# EAGLE schematic harp load cells interface v1.1 (EAGLE 6.5.0)

## Sheet 1 of 3
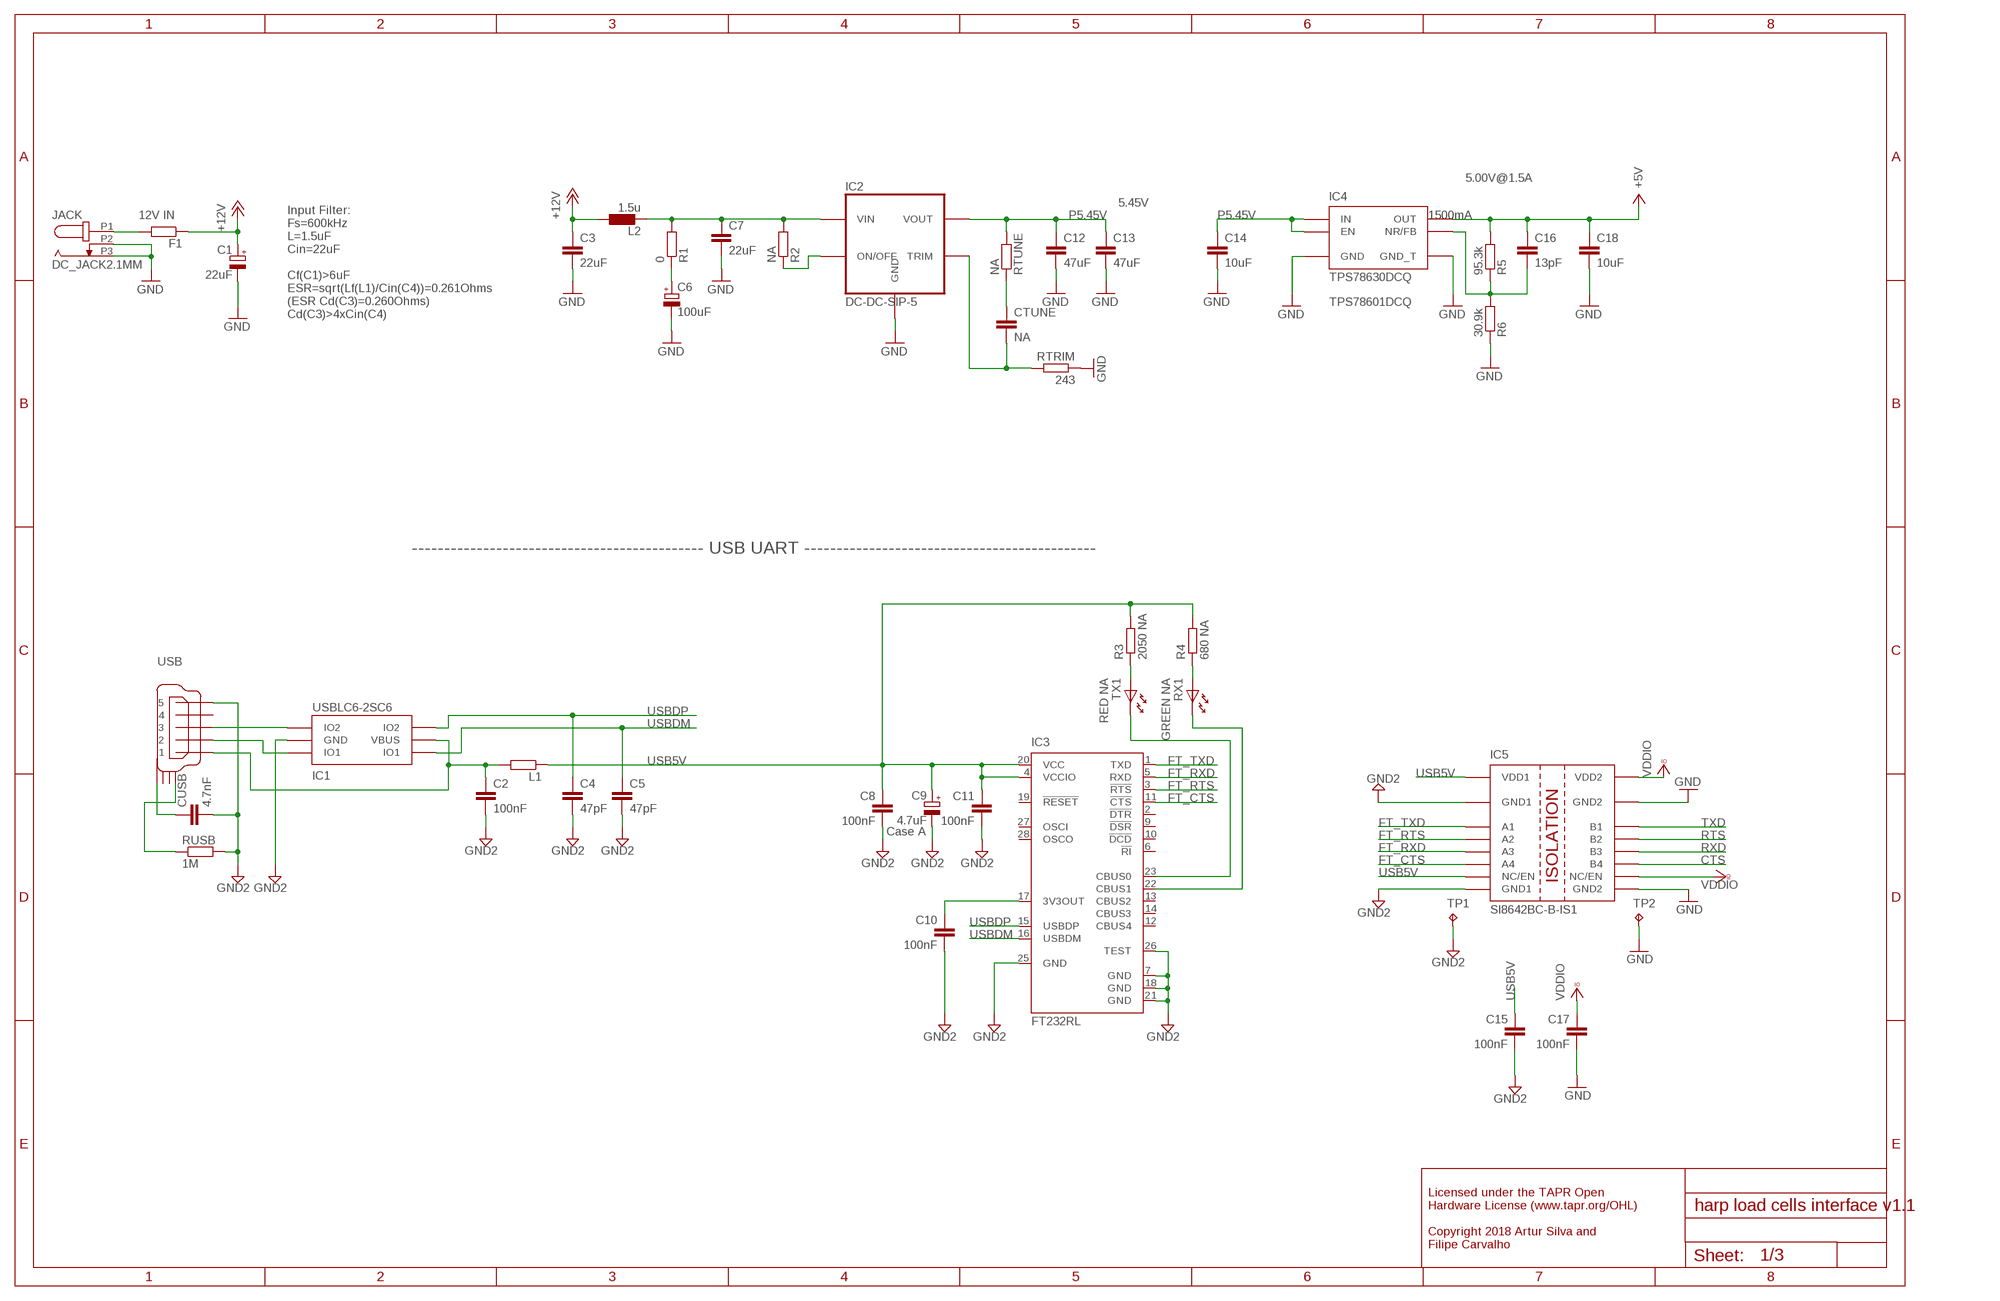
[diagram p0: schematic, sheet 1]

### Parts
C1  22uF  CAP_100UFHAND  [CAP_100UF_HAND]
C2  100nF  C-EUC0402  [C0402]
C3  22uF  C-EUC1210  [C1210]
C4  47pF  C-EUC0402  [C0402]
C5  47pF  C-EUC0402  [C0402]
C6  100uF  CPOL-EUE  [PANASONIC_E]
C7  22uF  C-EUC1210  [C1210]
C8  100nF  C-EUC0402  [C0402]
C9  4.7uF  CPOL-EUA/3216-18W  [A/3216-18W]
C10  100nF  C-EUC0402  [C0402]
C11  100nF  C-EUC0402  [C0402]
C12  47uF  C-EUC1210  [C1210]
C13  47uF  C-EUC1210  [C1210]
C14  10uF  C-EUC0603  [C0603]
C15  100nF  C-EUC0402  [C0402]
C16  13pF  C-EUC0402  [C0402]
C17  100nF  C-EUC0402  [C0402]
C18  10uF  C-EUC0603  [C0603]
CTUNE  NA  C-EUC0402  [C0402]
CUSB  4.7nF  C-EUC0402  [C0402]
F1  1A FB  R-EU_R0603  [R0603]
IC1  USBLC6-2SC6  USBLC6-2  [SOT23-6L]
IC2  DC-DC-SIP-5  [SIP-5]
IC3  FT232RL  [SSOP28]
IC4  TPS78630DCQ  TPS795XX  [SOT223-6]
IC5  SI8642BC-B-IS1  SI8645  [NSOIC-16]
JACK  DC_JACK2.1MM  [DC_POWER_INPUT_2.1MM]
L1  ???  R-EU_R0805  [R0805]
L2  1.5u  INDLPS4012  [IND_LPS4012]
R1  0  R-EU_R0402  [R0402]
R2  NA  R-EU_R0402  [R0402]
R3  2050 NA  R-EU_R0402  [R0402]
R4  680 NA  R-EU_R0402  [R0402]
R5  95.3k  R-EU_R0402  [R0402]
R6  30.9k  R-EU_R0402  [R0402]
RTRIM  243  R-EU_R0402  [R0402]
RTUNE  NA  R-EU_R0402  [R0402]
RUSB  1M  R-EU_R0402  [R0402]
RX1  GREEN NA  LEDHAND  [LED_HAND]
TP1  TPTP08SQ  [TP08SQ]
TP2  TPTP08SQ  [TP08SQ]
TX1  RED NA  LEDHAND  [LED_HAND]
USB  USB_MINI_B  [240-0002-1]

### Nets
3V3OUT: C10.1 IC3.17(3V3OUT)
+5V: C16.1 C18.1 IC4.P$4(OUT) R5.2 ; also sheet 2,3
+12V: C1.+ C3.1 F1.1 L2.1
CTS: IC5.11(B4) ; also sheet 2
DCIN: C7.1 IC2.P2(VIN) L2.2 R1.2 R2.2
FT_CTS: IC3.11(!CTS) IC5.6(A4)
FT_RTS: IC3.3(!RTS) IC5.4(A2)
FT_RXD: IC3.5(RXD) IC5.5(A3)
FT_TXD: IC3.1(TXD) IC5.3(A1)
GND: C1.- C3.2 C6.- C7.2 C12.2 C13.2 C14.2 C17.2 C18.2 IC2.P3(GND) IC4.P$3(GND) IC4.P$6(GND_T) IC5.9(GND2) IC5.15(GND2) JACK.P2 JACK.P3 R6.1 RTRIM.1 TP2.TP ; also sheet 2,3
GND2: C2.2 C4.2 C5.2 C8.2 C9.- C10.2 C11.2 C15.2 CUSB.2 IC1.P$2(GND) IC3.7(GND) IC3.18(GND) IC3.21(GND) IC3.25(GND) IC3.26(TEST) IC5.2(GND1) IC5.8(GND1) RUSB.2 TP1.TP USB.P$5
N$5: R4.1 RX1.A
N$7: IC3.22(CBUS1) RX1.K
N$12: CTUNE.2 IC2.P5(TRIM) RTRIM.2
N$13: IC1.P$3(IO2) USB.P$3
N$14: CTUNE.1 RTUNE.1
N$15: CUSB.1 USB.SHIELD_4
N$16: IC2.P1(ON/OFF) R2.1
N$18: F1.2 JACK.P1
N$20: C16.2 IC4.P$5(NR/FB) R5.1 R6.2
N$24: C6.+ R1.1
N$60: C2.1 IC1.P$5(VBUS) L1.2 USB.P$1
N$401: R3.1 TX1.A
N$591: IC3.23(CBUS0) TX1.K
N$601: RUSB.1 USB.SHIELD_1
N$701: IC1.P$1(IO1) USB.P$2
P5.45V: C12.1 C13.1 C14.1 IC2.P4(VOUT) IC4.P$1(EN) IC4.P$2(IN) RTUNE.2
RTS: IC5.13(B2) ; also sheet 2
RXD: IC5.12(B3) ; also sheet 2
TXD: IC5.14(B1) ; also sheet 2
USB5V: C8.1 C9.+ C11.1 C15.1 IC3.4(VCCIO) IC3.20(VCC) IC5.1(VDD1) IC5.7(NC/EN) L1.1 R3.2 R4.2
USBDM: C5.1 IC1.P$6(IO1) IC3.16(USBDM)
USBDP: C4.1 IC1.P$4(IO2) IC3.15(USBDP)
VCCIO: C17.1 IC5.10(NC/EN) IC5.16(VDD2) ; supply symbol labelled VDDIO ; also sheet 2,3
Unconnected: IC3.2(!DTR) IC3.6(!RI) IC3.9(!DSR) IC3.10(!DCD) IC3.12(CBUS4) IC3.13(CBUS2) IC3.14(CBUS3) IC3.19(!RESET) IC3.27(OSCI) IC3.28(OSCO) USB.P$4 USB.SHIELD_2 USB.SHIELD_3

### Notes on the sheet
- 5.00V@1.5A
- 5.45V
- 12V IN | 1500mA
- TPS78601DCQ
- Input Filter:
  Fs=600kHz
  L=1.5uF
  Cin=22uF
  
  Cf(C1)>6uF
  ESR=sqrt(Lf(L1)/Cin(C4))=0.261Ohms
  (ESR Cd(C3)=0.260Ohms)
  Cd(C3)>4xCin(C4)
- --------------------------------------------- USB UART ---------------------------------------------
- Case A
- Licensed under the TAPR Open
  Hardware License (www.tapr.org/OHL)
  
  Copyright 2018 Artur Silva and 
  Filipe Carvalho

## Sheet 2 of 3
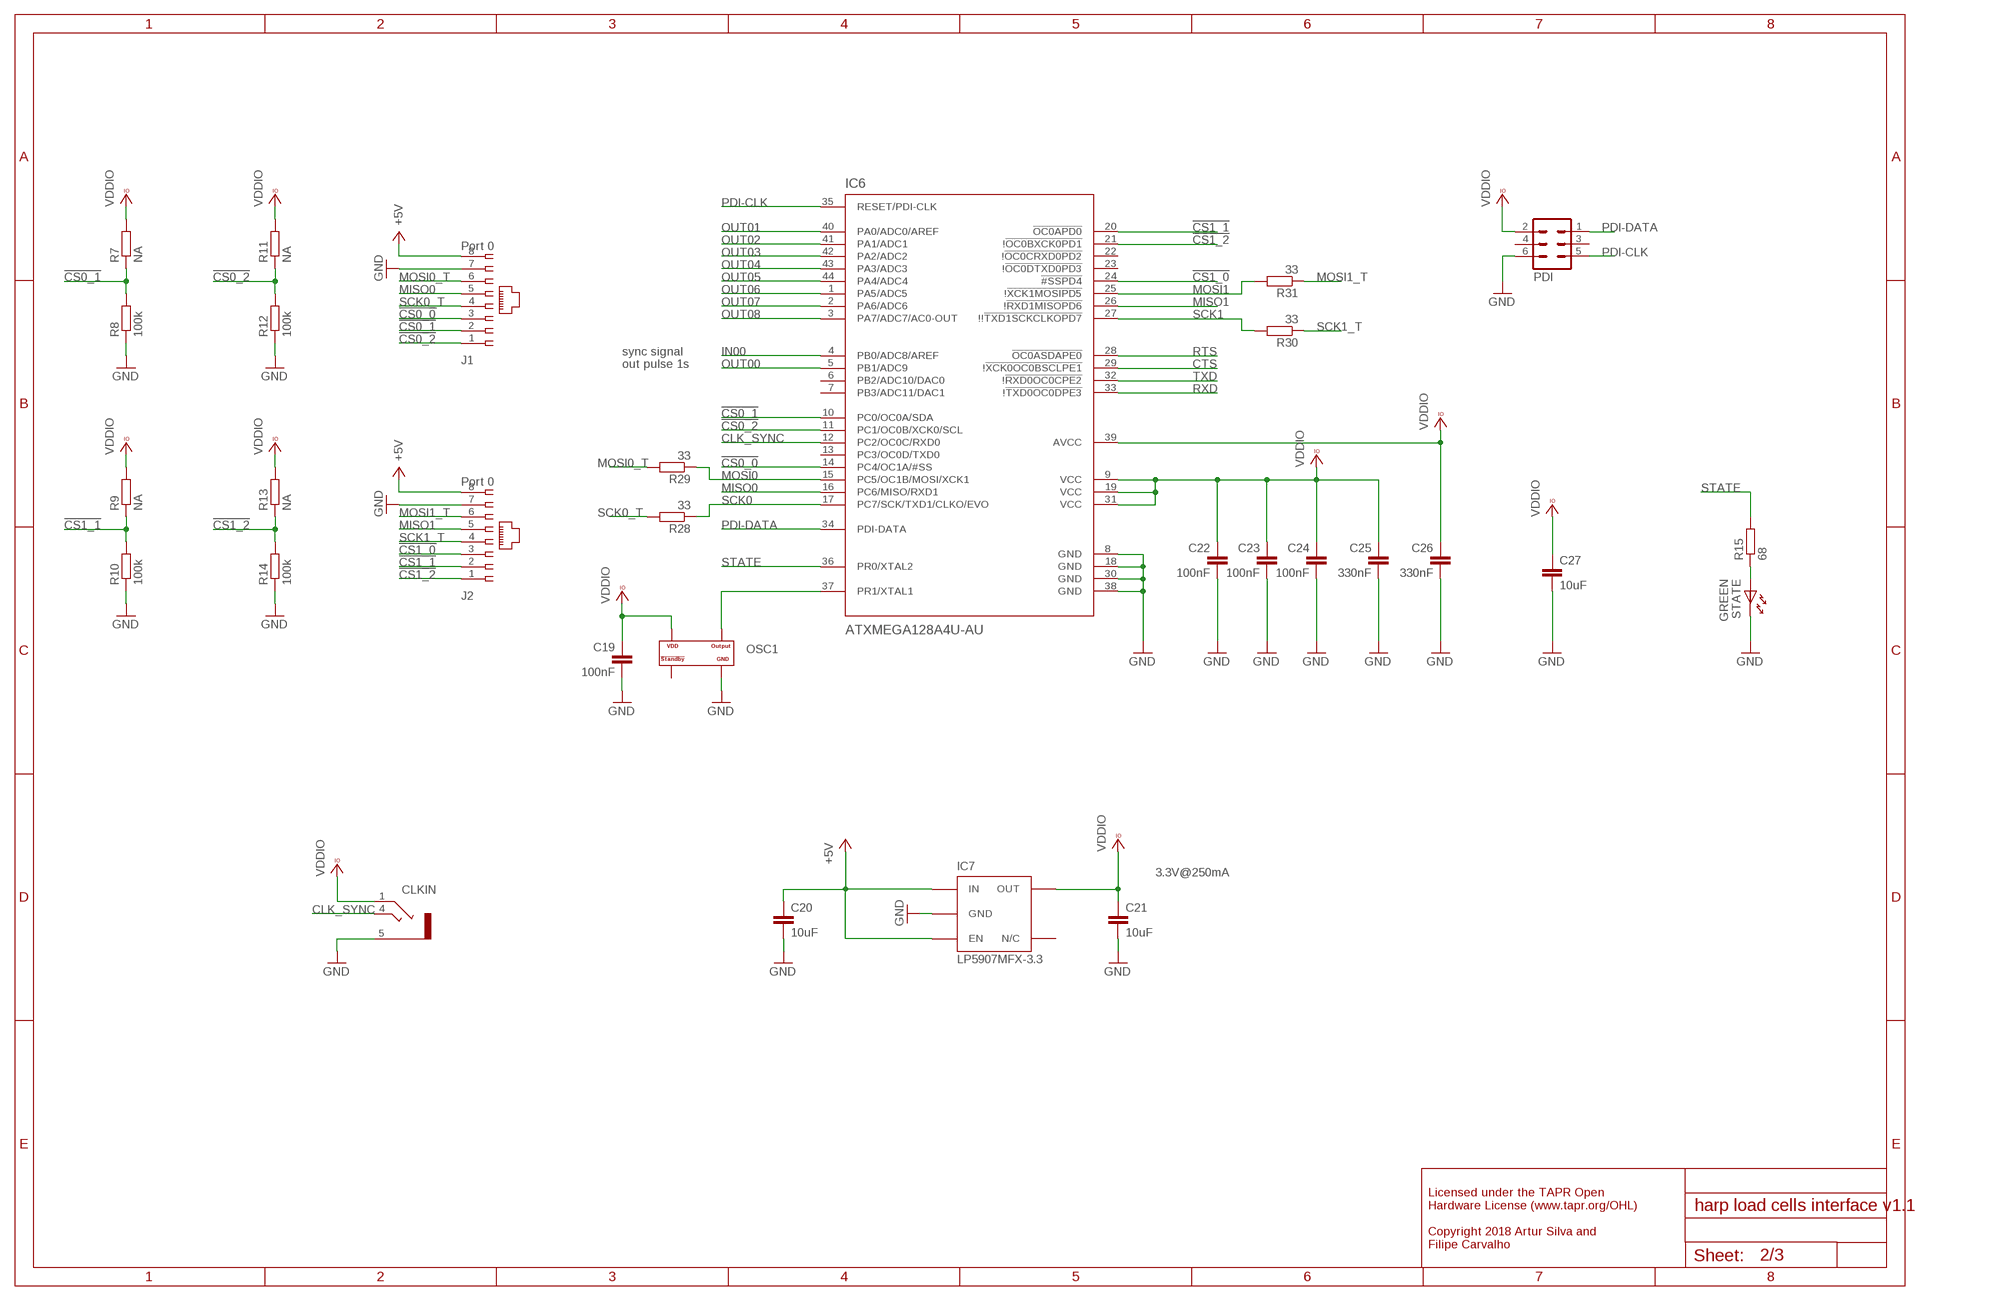
[diagram p1: schematic, sheet 2]

### Parts
C19  100nF  C-EUC0402  [C0402]
C20  10uF  C-EUC0603  [C0603]
C21  10uF  C-EUC0603  [C0603]
C22  100nF  C-EUC0402  [C0402]
C23  100nF  C-EUC0402  [C0402]
C24  100nF  C-EUC0402  [C0402]
C25  330nF  C-EUC0402  [C0402]
C26  330nF  C-EUC0402  [C0402]
C27  10uF  C-EUC0603  [C0603]
CLKIN  STEREO_JACK  [35RASMT2BHNTRX]
IC6  ATXMEGA128A4U-AU  AT-XMEGA-XXA4-AU  [QFP80P1200X1200X120-44N]
IC7  LP5907MFX-3.3  TLV700XX  [TSOT23-5]
J1  Port 0  520426-4  [520426-4]
J2  Port 0  520426-4  [520426-4]
OSC1  OSCILLATOR  [OSCILLATOR_3.2X2.5]
PDI  MA03-2  [MA03-2]
R7  NA  R-EU_R0402  [R0402]
R8  100k  R-EU_R0402  [R0402]
R9  NA  R-EU_R0402  [R0402]
R10  100k  R-EU_R0402  [R0402]
R11  NA  R-EU_R0402  [R0402]
R12  100k  R-EU_R0402  [R0402]
R13  NA  R-EU_R0402  [R0402]
R14  100k  R-EU_R0402  [R0402]
R15  68  R-EU_R0402  [R0402]
R28  33  R-EU_R0402  [R0402]
R29  33  R-EU_R0402  [R0402]
R30  33  R-EU_R0402  [R0402]
R31  33  R-EU_R0402  [R0402]
STATE  GREEN  LEDHAND  [LED_HAND]

### Nets
!CS0_0: IC6.14(PC4/OC1A/#SS) J1.3
!CS0_1: IC6.10(PC0/OC0A/SDA) J1.2 R7.1 R8.2
!CS0_2: IC6.11(PC1/OC0B/XCK0/SCL) J1.1 R11.1 R12.2
!CS1_0: IC6.24(!#SSPD4) J2.3
!CS1_1: IC6.20(!OC0APD0) J2.2 R9.1 R10.2
!CS1_2: IC6.21(!!OC0BXCK0PD1) J2.1 R13.1 R14.2
+5V: C20.1 IC7.1(IN) IC7.3(EN) J1.8 J2.8 ; also sheet 1,3
CLK_SYNC: CLKIN.4 IC6.12(PC2/OC0C/RXD0)
CTS: IC6.29(!!XCK0OC0BSCLPE1) ; also sheet 1
GND: C19.2 C20.2 C21.2 C22.2 C23.2 C24.2 C25.2 C26.2 C27.2 CLKIN.5 IC6.8(GND) IC6.18(GND) IC6.30(GND) IC6.38(GND) IC7.2(GND) J1.7 J2.7 OSC1.P$2(GND) PDI.6 R8.1 R10.1 R12.1 R14.1 STATE.K ; also sheet 1,3
IN00: IC6.4(PB0/ADC8/AREF) ; also sheet 3
MISO0: IC6.16(PC6/MISO/RXD1) J1.5
MISO1: IC6.26(!!RXD1MISOPD6) J2.5
MOSI0: IC6.15(PC5/OC1B/MOSI/XCK1) R29.1
MOSI0_T: J1.6 R29.2
MOSI1: IC6.25(!!XCK1MOSIPD5) R31.2
MOSI1_T: J2.6 R31.1
N$23: R15.1 STATE.A
OSC1: IC6.37(PR1/XTAL1) OSC1.P$3(OUTPUT)
OUT00: IC6.5(PB1/ADC9) ; also sheet 3
OUT01: IC6.40(PA0/ADC0/AREF) ; also sheet 3
OUT02: IC6.41(PA1/ADC1) ; also sheet 3
OUT03: IC6.42(PA2/ADC2) ; also sheet 3
OUT04: IC6.43(PA3/ADC3) ; also sheet 3
OUT05: IC6.44(PA4/ADC4) ; also sheet 3
OUT06: IC6.1(PA5/ADC5) ; also sheet 3
OUT07: IC6.2(PA6/ADC6) ; also sheet 3
OUT08: IC6.3(PA7/ADC7/AC0-OUT) ; also sheet 3
PDI-CLK: IC6.35(RESET/PDI-CLK) PDI.5
PDI-DATA: IC6.34(PDI-DATA) PDI.1
RTS: IC6.28(!OC0ASDAPE0) ; also sheet 1
RXD: IC6.33(!!TXD0OC0DPE3) ; also sheet 1
SCK0: IC6.17(PC7/SCK/TXD1/CLKO/EVO) R28.1
SCK0_T: J1.4 R28.2
SCK1: IC6.27(!!!TXD1SCKCLKOPD7) R30.2
SCK1_T: J2.4 R30.1
STATE: IC6.36(PR0/XTAL2) R15.2
TXD: IC6.32(!!RXD0OC0CPE2) ; also sheet 1
VCCIO: C19.1 C21.1 C22.1 C23.1 C24.1 C25.1 C26.1 C27.1 CLKIN.1 IC6.9(VCC) IC6.19(VCC) IC6.31(VCC) IC6.39(AVCC) IC7.5(OUT) OSC1.P$4(VDD) PDI.2 R7.2 R9.2 R11.2 R13.2 ; supply symbol labelled VDDIO ; also sheet 1,3
Unconnected: IC6.6(PB2/ADC10/DAC0) IC6.7(PB3/ADC11/DAC1) IC6.13(PC3/OC0D/TXD0) IC6.22(!!OC0CRXD0PD2) IC6.23(!!OC0DTXD0PD3) IC7.4(N/C) OSC1.P$1(STANDBY#) PDI.3 PDI.4

### Notes on the sheet
- sync signal
- out pulse 1s
- 3.3V@250mA
- Licensed under the TAPR Open
  Hardware License (www.tapr.org/OHL)
  
  Copyright 2018 Artur Silva and 
  Filipe Carvalho

## Sheet 3 of 3
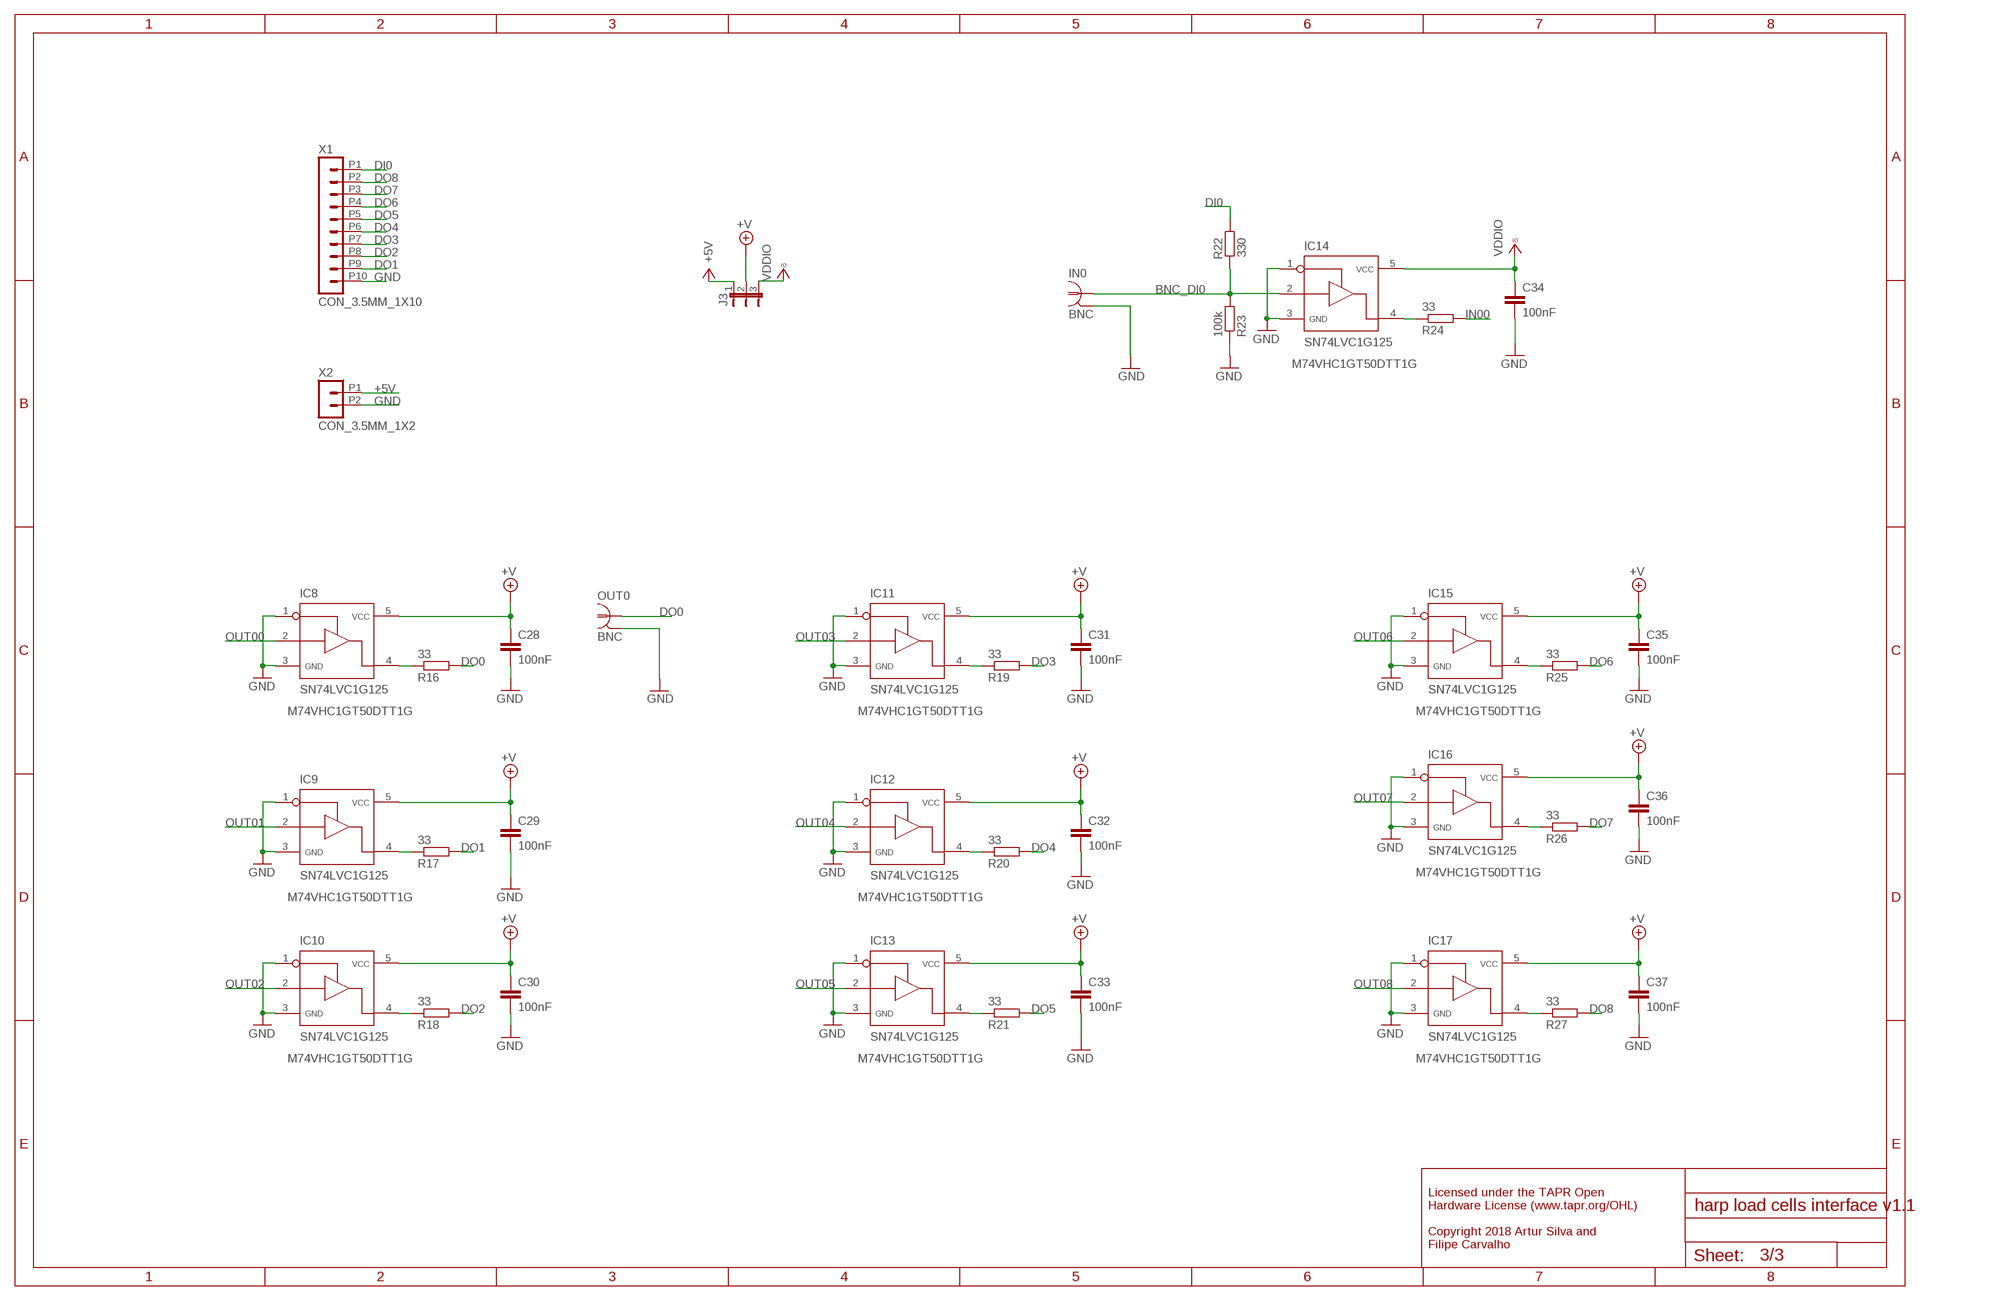
[diagram p2: schematic, sheet 3]

### Parts
C28  100nF  C-EUC0402  [C0402]
C29  100nF  C-EUC0402  [C0402]
C30  100nF  C-EUC0402  [C0402]
C31  100nF  C-EUC0402  [C0402]
C32  100nF  C-EUC0402  [C0402]
C33  100nF  C-EUC0402  [C0402]
C34  100nF  C-EUC0402  [C0402]
C35  100nF  C-EUC0402  [C0402]
C36  100nF  C-EUC0402  [C0402]
C37  100nF  C-EUC0402  [C0402]
IC8  SN74LVC1G125  [SOT23-5]
IC9  SN74LVC1G125  [SOT23-5]
IC10  SN74LVC1G125  [SOT23-5]
IC11  SN74LVC1G125  [SOT23-5]
IC12  SN74LVC1G125  [SOT23-5]
IC13  SN74LVC1G125  [SOT23-5]
IC14  SN74LVC1G125  [SOT23-5]
IC15  SN74LVC1G125  [SOT23-5]
IC16  SN74LVC1G125  [SOT23-5]
IC17  SN74LVC1G125  [SOT23-5]
IN0  BNC  [BNC_RA]
J3  JP2E  [JP2]
OUT0  BNC  [BNC_RA]
R16  33  R-EU_R0402  [R0402]
R17  33  R-EU_R0402  [R0402]
R18  33  R-EU_R0402  [R0402]
R19  33  R-EU_R0402  [R0402]
R20  33  R-EU_R0402  [R0402]
R21  33  R-EU_R0402  [R0402]
R22  330  R-EU_R0402  [R0402]
R23  100k  R-EU_R0402  [R0402]
R24  33  R-EU_R0402  [R0402]
R25  33  R-EU_R0402  [R0402]
R26  33  R-EU_R0402  [R0402]
R27  33  R-EU_R0402  [R0402]
X1  CON_3.5MM_1X10  [CON_3.5MM_1X10]
X2  CON_3.5MM_1X2  [CON_3.5MM_1X2]

### Nets
+5V: J3.1 X2.P1 ; also sheet 1,2
+V: C28.1 C29.1 C30.1 C31.1 C32.1 C33.1 C35.1 C36.1 C37.1 IC8.5 IC9.5 IC10.5 IC11.5 IC12.5 IC13.5 IC15.5 IC16.5 IC17.5 J3.2
BNC_DI0: IC14.2 IN0.1 R22.2 R23.2
DI0: R22.1 X1.P1
DO0: OUT0.1 R16.2
DO1: R17.2 X1.P9
DO2: R18.2 X1.P8
DO3: R19.2 X1.P7
DO4: R20.2 X1.P6
DO5: R21.2 X1.P5
DO6: R25.2 X1.P4
DO7: R26.2 X1.P3
DO8: R27.2 X1.P2
GND: C28.2 C29.2 C30.2 C31.2 C32.2 C33.2 C34.2 C35.2 C36.2 C37.2 IC8.1 IC8.3 IC9.1 IC9.3 IC10.1 IC10.3 IC11.1 IC11.3 IC12.1 IC12.3 IC13.1 IC13.3 IC14.1 IC14.3 IC15.1 IC15.3 IC16.1 IC16.3 IC17.1 IC17.3 IN0.2 OUT0.2 R23.1 X1.P10 X2.P2 ; also sheet 1,2
IN00: R24.2 ; also sheet 2
N$1: IC16.4 R26.1
N$2: IC15.4 R25.1
N$4: IC10.4 R18.1
N$6: IC17.4 R27.1
N$8: IC9.4 R17.1
N$9: IC12.4 R20.1
N$11: IC8.4 R16.1
N$17: IC13.4 R21.1
N$19: IC11.4 R19.1
N$21: IC14.4 R24.1
OUT00: IC8.2 ; also sheet 2
OUT01: IC9.2 ; also sheet 2
OUT02: IC10.2 ; also sheet 2
OUT03: IC11.2 ; also sheet 2
OUT04: IC12.2 ; also sheet 2
OUT05: IC13.2 ; also sheet 2
OUT06: IC15.2 ; also sheet 2
OUT07: IC16.2 ; also sheet 2
OUT08: IC17.2 ; also sheet 2
VCCIO: C34.1 IC14.5 J3.3 ; supply symbol labelled VDDIO ; also sheet 1,2

### Notes on the sheet
- M74VHC1GT50DTT1G
- M74VHC1GT50DTT1G | M74VHC1GT50DTT1G | M74VHC1GT50DTT1G
- M74VHC1GT50DTT1G
- M74VHC1GT50DTT1G | M74VHC1GT50DTT1G
- M74VHC1GT50DTT1G | M74VHC1GT50DTT1G | M74VHC1GT50DTT1G
- Licensed under the TAPR Open
  Hardware License (www.tapr.org/OHL)
  
  Copyright 2018 Artur Silva and 
  Filipe Carvalho

## Library data of the parts
C1 = CNP-miscellaneous:CAP_100UF
C2-C5 C7 C8 C10-C37 CTUNE CUSB = rcl:C-EU: CAPACITOR, European symbol
C6 C9 = rcl:CPOL-EU: POLARIZED CAPACITOR, European symbol
CLKIN = CNP-connectors:STEREO_JACK
F1 L1 R1-R31 RTRIM RTUNE RUSB = rcl:R-EU_: RESISTOR, European symbol
IC1 = CNP 2:USBLC6-2
IC2 = CNP-connectors:DC-DC-SIP-5
IC3 = ftdichip:FT232R: Source: http://www.ftdichip.com/Documents/DataSheets/DS_FT232R_v104.pdf; MPN: FT232RL; OC_FARNELL: 1146032; OC_NEWARK: 91K9918
IC4 = CNP:TPS795XX
IC5 = CNP-ics 2:SI8645
IC6 = xmega-a4:AT-XMEGA-XXA4-AU: ATxMega a4 Serie
IC7 = CNP:TLV700XX
IC8-IC17 = My_library 0v2:SN74LVC1G125
IN0 OUT0 = CNP-connectors:BNC
J1 J2 = con-amp:520426-4: AMP connector
J3 = jumper:JP2E: JUMPER
JACK = CNP-miscellaneous:DC_JACK
L2 = CNP-miscellaneous:IND
OSC1 = CNP-miscellaneous:OSCILLATOR
PDI = con-lstb:MA03-2: PIN HEADER; OC_FARNELL: unknown; OC_NEWARK: unknown
RX1 STATE TX1 = CNP-miscellaneous:LED
TP1 TP2 = testpad:TP: Test pad
USB = CNP-connectors:USB_MINI_B
X1 = CNP-connectors:CON_3.5MM_1X10
X2 = CNP-connectors:CON_3.5MM_1X2